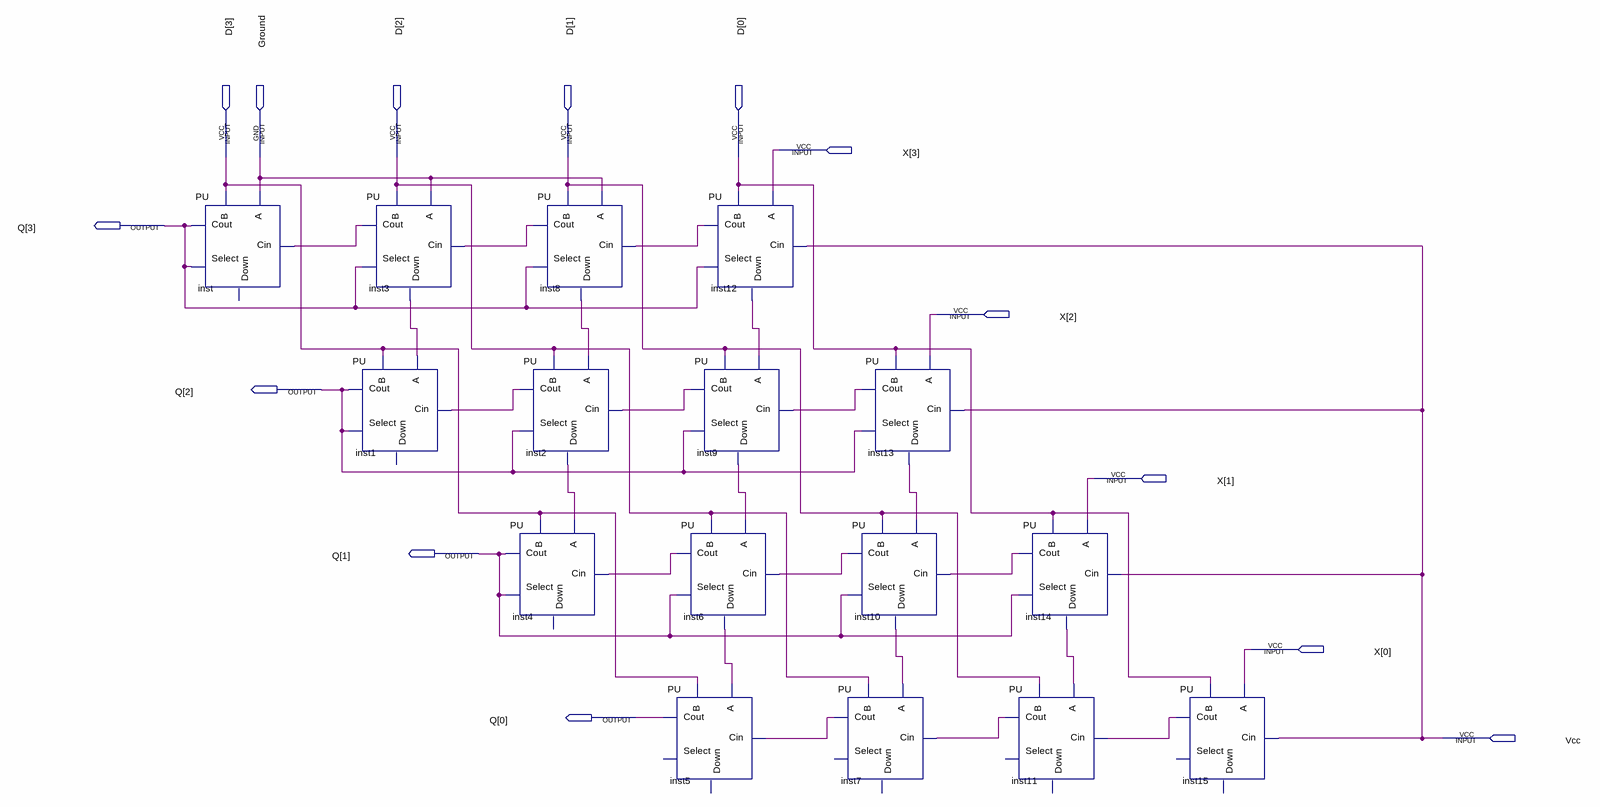
[diagram p0: schematic sheet]
// Quartus schematic DividerCircuit.bdf as structural Verilog: 16 symbols, 14 pins
module DividerCircuit (
  input  [3:0] X,
  input  [3:0] D,
  input  Ground,
  input  Vcc,
  output [3:0] Q
);

  wire inst2_cout, inst2_down, inst3_cout, inst3_down, inst6_cout, inst6_down, inst7_cout, inst8_cout,
       inst8_down, inst9_cout, inst9_down, inst10_cout, inst10_down, inst11_cout, inst12_cout, inst12_down,
       inst13_cout, inst13_down, inst14_cout, inst14_down, inst15_cout;

  PU inst (.B(D[3]), .A(Ground), .Cin(inst3_cout), .Select(Q[3]), .Cout(Q[3]));  // open: Down
  PU inst3 (.B(D[2]), .A(Ground), .Cin(inst8_cout), .Select(Q[3]), .Cout(inst3_cout), .Down(inst3_down));
  PU inst1 (.B(D[3]), .A(inst3_down), .Cin(inst2_cout), .Select(Q[2]), .Cout(Q[2]));  // open: Down
  PU inst4 (.B(D[3]), .A(inst2_down), .Cin(inst6_cout), .Select(Q[1]), .Cout(Q[1]));  // open: Down
  PU inst8 (.B(D[1]), .A(Ground), .Cin(inst12_cout), .Select(Q[3]), .Cout(inst8_cout), .Down(inst8_down));
  PU inst2 (.B(D[2]), .A(inst8_down), .Cin(inst9_cout), .Select(Q[2]), .Cout(inst2_cout), .Down(inst2_down));
  PU inst5 (.B(D[3]), .A(inst6_down), .Cin(inst7_cout), .Cout(Q[0]));  // open: Select, Down
  PU inst12 (.B(D[0]), .A(X[3]), .Cin(Vcc), .Select(Q[3]), .Cout(inst12_cout), .Down(inst12_down));
  PU inst9 (.B(D[1]), .A(inst12_down), .Cin(inst13_cout), .Select(Q[2]), .Cout(inst9_cout), .Down(inst9_down));
  PU inst6 (.B(D[2]), .A(inst9_down), .Cin(inst10_cout), .Select(Q[1]), .Cout(inst6_cout), .Down(inst6_down));
  PU inst7 (.B(D[2]), .A(inst10_down), .Cin(inst11_cout), .Cout(inst7_cout));  // open: Select, Down
  PU inst13 (.B(D[0]), .A(X[2]), .Cin(Vcc), .Select(Q[2]), .Cout(inst13_cout), .Down(inst13_down));
  PU inst10 (.B(D[1]), .A(inst13_down), .Cin(inst14_cout), .Select(Q[1]), .Cout(inst10_cout), .Down(inst10_down));
  PU inst14 (.B(D[0]), .A(X[1]), .Cin(Vcc), .Select(Q[1]), .Cout(inst14_cout), .Down(inst14_down));
  PU inst11 (.B(D[1]), .A(inst14_down), .Cin(inst15_cout), .Cout(inst11_cout));  // open: Select, Down
  PU inst15 (.B(D[0]), .A(X[0]), .Cin(Vcc), .Cout(inst15_cout));  // open: Select, Down
endmodule
